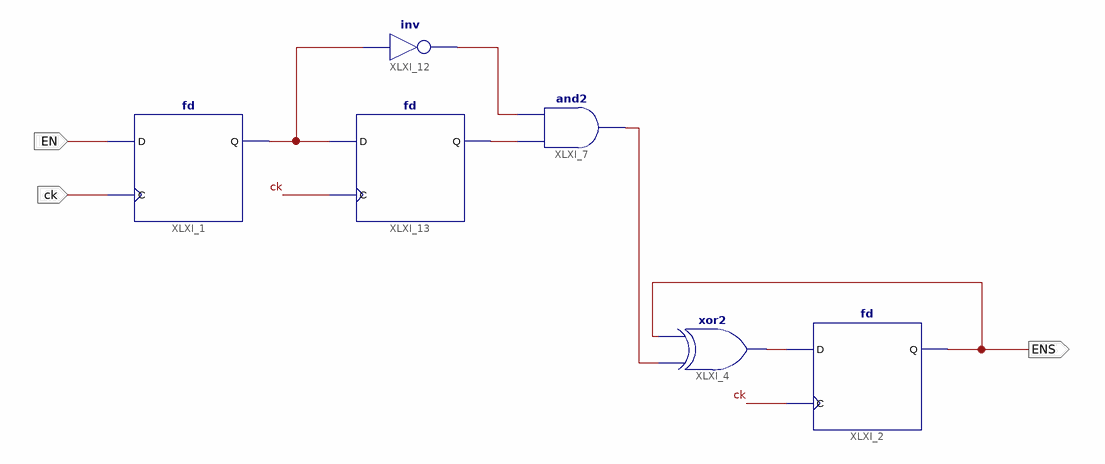
[diagram p0: schematic sheet 1]
// Xilinx ISE schematic Puls_On_Off.sch (spartan6) as structural Verilog: 6 symbols, 3 ports
module Puls_On_Off (
  input  ck,
  input  EN,
  output ENS
);

  wire XLXN_6, XLXN_16, XLXN_26, XLXN_27, XLXN_33;

  and XLXI_7 (XLXN_33, XLXN_27, XLXN_26);
  fd XLXI_1 (.C(ck), .D(EN), .Q(XLXN_16));
  not XLXI_12 (XLXN_26, XLXN_16);
  fd XLXI_2 (.C(ck), .D(XLXN_6), .Q(ENS));
  xor XLXI_4 (XLXN_6, XLXN_33, ENS);
  fd XLXI_13 (.C(ck), .D(XLXN_16), .Q(XLXN_27));
endmodule
